# Altium schematic sheet vista_frontal_sin_disparo.SchDoc
size A
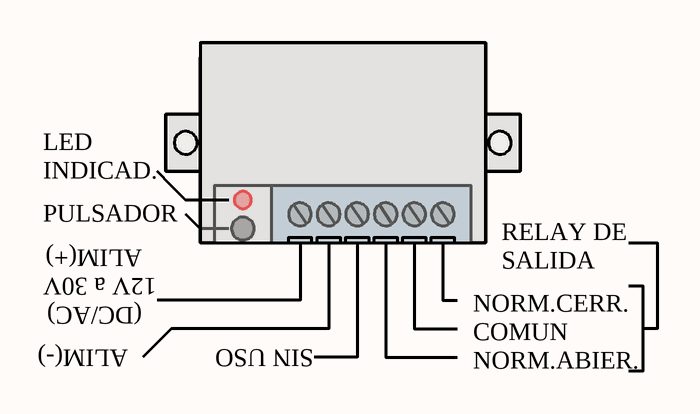
[diagram p0: vista_frontal_sin_disparo.SchDoc]

## Notes on the sheet
- INDICAD.
- PULSADOR
- LED
- ALIM(+)
- 12V a 30V
- ALIM(-)
- (DC/AC)
- SIN USO
- NORM.CERR.
  COMUN
  NORM.ABIER.
- RELAY DE SALIDA